# EAGLE design dIRKey (EAGLE 9.0.1)
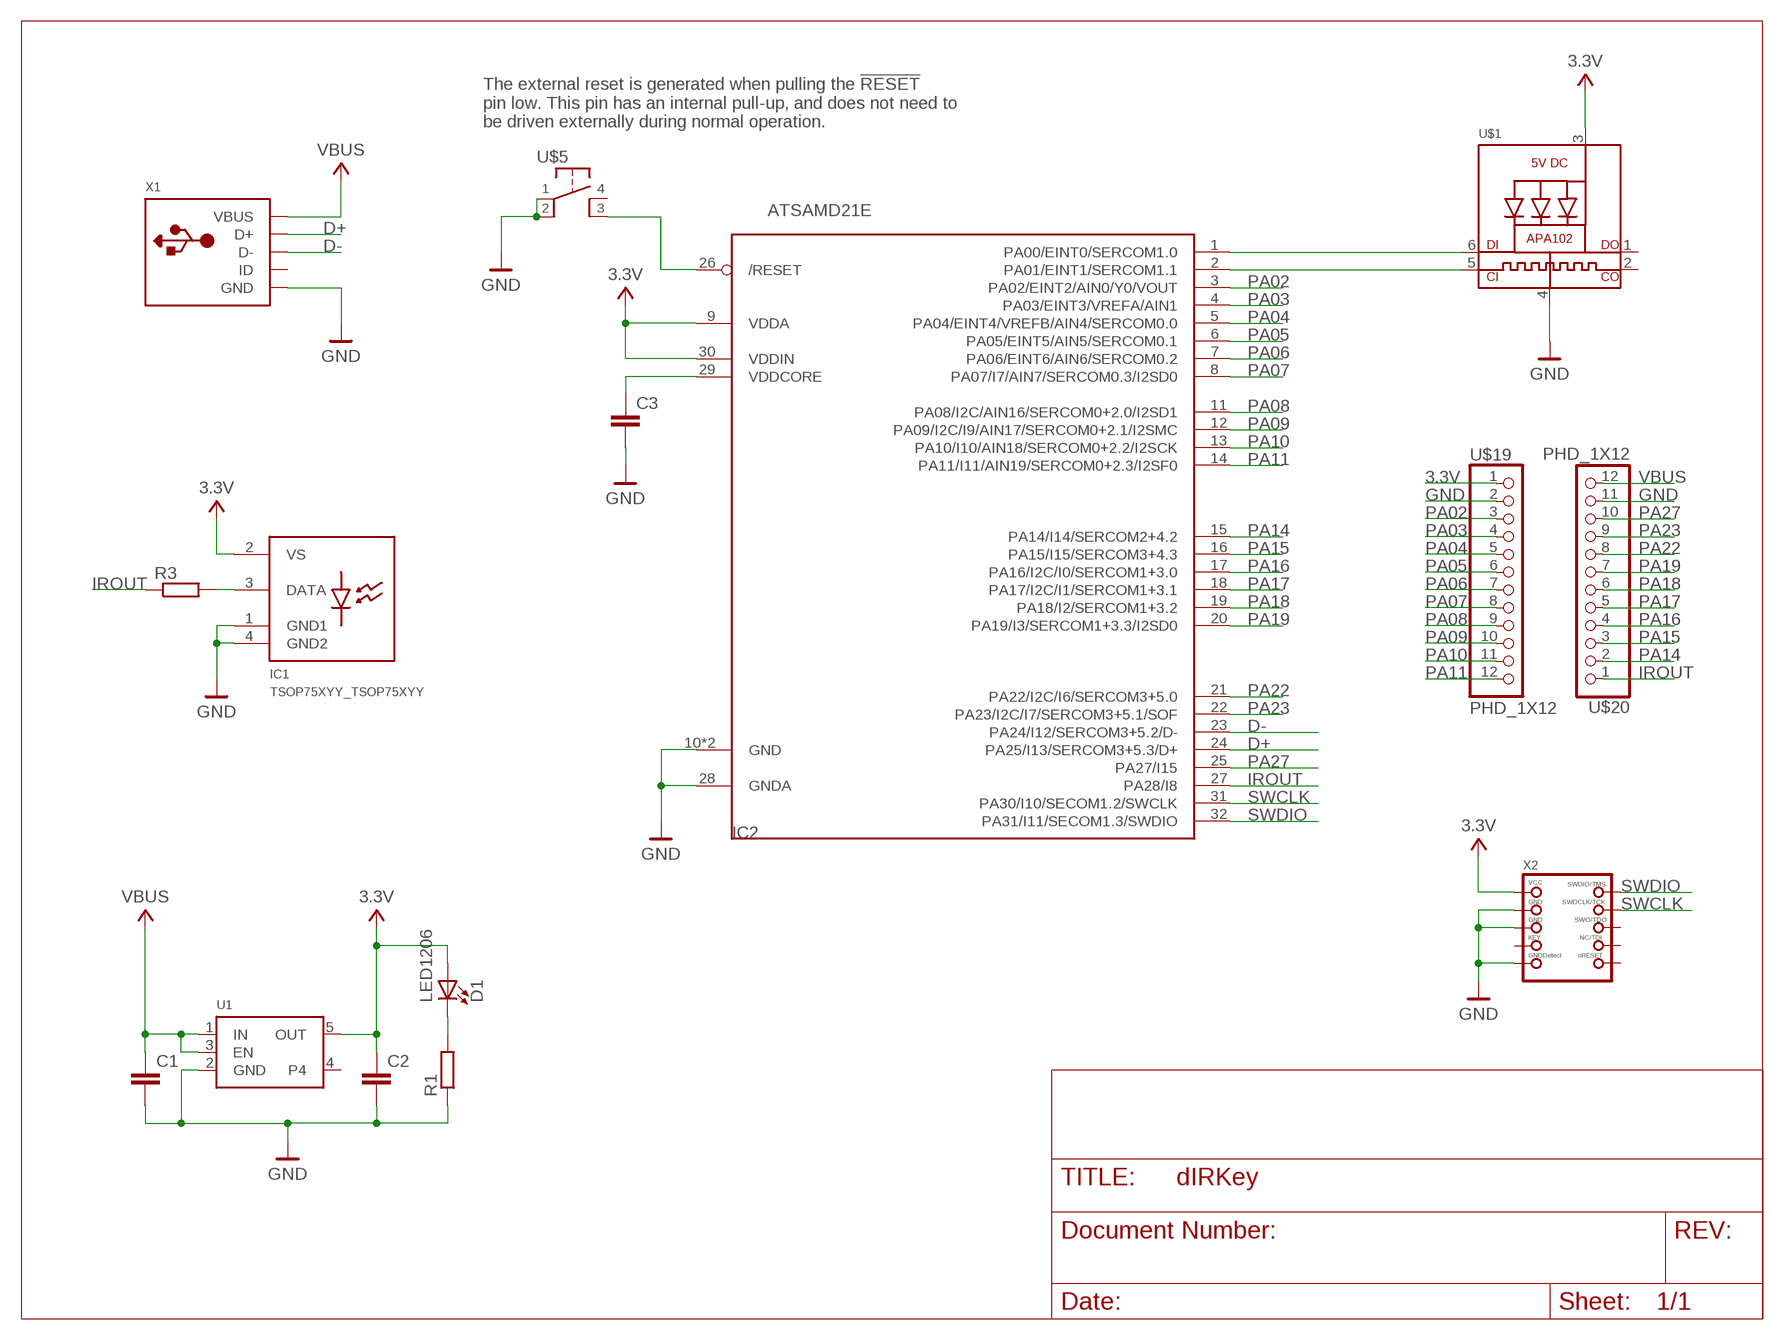
[diagram p0: schematic, sheet 1]

## Parts
C1  C-EUC1206  [C1206]
C2  C-EUC1206  [C1206]
C3  C-EUC1206  [C1206]
D1  LED1206  [LED1206]
IC1  TSOP75XYY_TSOP75XYY  [TSOP75XYY_TSOP75XYY]
IC2  ATSAMD21E  [QFN32_5MM]
R1  R-EU_R1206  [R1206]
R3  R-EU_R1206  [R1206]
U1  AP2112K  [SOT23-5]
U$1  DOTSTAR_APA1022020  [APA102_2020]
U$5  PTS647  [PTS647]
U$19  PHD_1X12  [PHD_1X12]
U$20  PHD_1X12  [PHD_1X12]
X1  USB_MICRO_BMICRO_20329  [USB_MICRO_B]
X2  SWD_2X5  [SWD_MINI]

## Nets
3.3V: C2.1 D1.2(A) IC1.2(VS) IC2.9(VDDA) IC2.30(VDDIN) U1.5(OUT) U$1.3(VDD) U$19.1 X2.1(VCC)
D+: IC2.24(PA25/I13/SERCOM3+5.3/D+) X1.D+
D-: IC2.23(PA24/I12/SERCOM3+5.2/D-) X1.D-
GND: C1.2 C2.2 C3.2 IC1.1(GND1) IC1.4(GND2) IC2.10(GND) IC2.28(GNDA) IC2.33(GND) R1.1 U1.2(GND) U$1.4(GND) U$5.1 U$5.2 U$19.2 U$20.11 X1.BASE@1(GND) X1.BASE@2(GND) X1.GND X1.SPRT@1(GND) X1.SPRT@2(GND) X1.SPRT@3(GND) X1.SPRT@4(GND) X2.3(GND) X2.5(GND) X2.9(GNDDETECT)
IROUT: IC2.27(PA28/I8) R3.1 U$20.1
N$1: IC2.1(PA00/EINT0/SERCOM1.0) U$1.6(DI)
N$2: IC2.2(PA01/EINT1/SERCOM1.1) U$1.5(CKI)
N$3: D1.1(C) R1.2
N$4: IC1.3(DATA) R3.2
N$7: C3.1 IC2.29(VDDCORE)
N$8: IC2.26(/RESET) U$5.3
PA02: IC2.3(PA02/EINT2/AIN0/Y0/VOUT) U$19.3
PA03: IC2.4(PA03/EINT3/VREFA/AIN1) U$19.4
PA04: IC2.5(PA04/EINT4/VREFB/AIN4/SERCOM0.0) U$19.5
PA05: IC2.6(PA05/EINT5/AIN5/SERCOM0.1) U$19.6
PA06: IC2.7(PA06/EINT6/AIN6/SERCOM0.2) U$19.7
PA07: IC2.8(PA07/I7/AIN7/SERCOM0.3/I2SD0) U$19.8
PA08: IC2.11(PA08/I2C/AIN16/SERCOM0+2.0/I2SD1) U$19.9
PA09: IC2.12(PA09/I2C/I9/AIN17/SERCOM0+2.1/I2SMC) U$19.10
PA10: IC2.13(PA10/I10/AIN18/SERCOM0+2.2/I2SCK) U$19.11
PA11: IC2.14(PA11/I11/AIN19/SERCOM0+2.3/I2SF0) U$19.12
PA14: IC2.15(PA14/I14/SERCOM2+4.2) U$20.2
PA15: IC2.16(PA15/I15/SERCOM3+4.3) U$20.3
PA16: IC2.17(PA16/I2C/I0/SERCOM1+3.0) U$20.4
PA17: IC2.18(PA17/I2C/I1/SERCOM1+3.1) U$20.5
PA18: IC2.19(PA18/I2/SERCOM1+3.2) U$20.6
PA19: IC2.20(PA19/I3/SERCOM1+3.3/I2SD0) U$20.7
PA22: IC2.21(PA22/I2C/I6/SERCOM3+5.0) U$20.8
PA23: IC2.22(PA23/I2C/I7/SERCOM3+5.1/SOF) U$20.9
PA27: IC2.25(PA27/I15) U$20.10
SWCLK: IC2.31(PA30/I10/SECOM1.2/SWCLK) X2.4(SWDCLK)
SWDIO: IC2.32(PA31/I11/SECOM1.3/SWDIO) X2.2(SWDIO)
VBUS: C1.1 U1.1(IN) U1.3(EN) U$20.12 X1.VBUS
Unconnected: U1.4 U$1.1(DO) U$1.2(CKO) U$5.4 X1.ID X2.6(SWO) X2.7(KEY) X2.8(TDI) X2.10(NRESET)

## Notes on the sheet
- The external reset is generated when pulling the !RESET
  pin low. This pin has an internal pull-up, and does not need to
  be driven externally during normal operation.

## Library data of the parts
C1-C3 = rcl:C-EU: CAPACITOR, European symbol; SPICEPREFIX: C
D1 = Ooo-LED:LED1206
IC1 = Ooo-Sensors-Optical:TSOP75XYY_TSOP75XYY: Vishay TSOP75XYY, where X is 2 (normal), or 4 (high noise environments, and YY is the demodulation frequency (36, 38, 40 KHz).
IC2 = Ooo-IC-Microcontroller:ATSAMD21E
R1 R3 = rcl:R-EU_: RESISTOR, European symbol; SPICEPREFIX: R
U1 = Ooo-IC-Power:AP2112K: SOT23-5 Fixed Voltage Regulators Part Current Out V Out V In V Dropout θJA (°C/W) TJ (°C) Digikey Part No. ADP121 150mA 3.3V 3.4-5.5V 0.09V @ 150mA -- -- ADP121-AUJZ33R7CT-ND ADP121 150mA 3.0V 3.1-5.5V 0.09V @ 150mA -- -- ADP121-AUJZ30R7CT-ND ADP122 300mA 3.3V 3.4-5.5V 0.085V @ 300mA -- -- ADP122AUJZ-3.3-R7CT-ND ADP1712 300mA 3.3V 3.5-5.5V 0.17V @ 300mA -- -- ADP1712AUJZ-3.3-R7TR-ND AP7311 (Low Cost) 150mA 3.3V 3.5-6V 0.15V @ 150mA -- -- AP7311-33WG-7DICT-ND LD39015M18R 150mA 1.8V 1.9V-5.5V 0.08V @ 100mA -- -- 497-6977-1-ND LP2985A-33DBVR 150mA 3.3V 3.3-16V 0.28V @ 150mA 206 150 296-18479-1-ND MCP1824T-3302E/OT 300mA 3.3V 3.5V-6V 0.2V @ 300mA -- -- MCP1824T-3302E/OTCT-ND MIC5205-2.5YM5 TR 150mA 2.5V 2.7-16V 0.165V @ 150mA -- -- 576-1257-2-ND MIC5205-3.0YM5 TR 150mA 3.0V 3.2V-16V 0.165V @ 150mA -- -- 576-1258-2-ND MIC5205-3.3YM5 TR 150mA 3.3V 3.5V-16V 0.165V @ 150mA -- -- 576-1259-2-ND TPS780330220 150mA 3.3V+2.2V 3.6-5.5V 250mV Max -- -- 296-23332-1-ND TDA3663/N1,135 100mA 3.3V 3.5-45V 0.18V @ 50mA -- -- 568-5343-1-ND Max operating temp can be calculated using θJA, TJ (max junction temperature), and power in watts. Set the "Maximum Ambient Temperature" until it reaches TJ ("Max Junction Temperature"), which is the absolute limit for safe use of the regulator: Heat Sink Temperature Calculator <http://www.daycounter.com/Calculators/Heat-Sink-Temperature-Calculator.phtml> For example, With 12V source into a 3.3V LP2985 and a 30mA load, we are dissipating (12V-3.3V) * 0.03A = 0.261W. With a θJA of 206 °C/W, a TJ of 150°C, and 261mW we can safely use the chip without a heat sink up to 75°C (=147.1°C Junction Temperature).
U$1 = Ooo-LED:DOTSTAR_APA102: APA102/DotStar Pixels VCC: 5V DC Refresh Rate: 400Hz
U$5 = Ooo-Switches:PTS647: C&K PTS647 Tact Switch
U$19 U$20 = Ooo-Connectors:PHD_1X12
X1 = Ooo-Connectors:USB_MICRO_B: USB Connectors USBMINIB - Surface Mount Female Mini-B USB Connector 4UConnector: 06564
X2 = Ooo-Connectors:SWD_2X5: SWD Connector Standard 0.05" 10-pin connector.

## Board
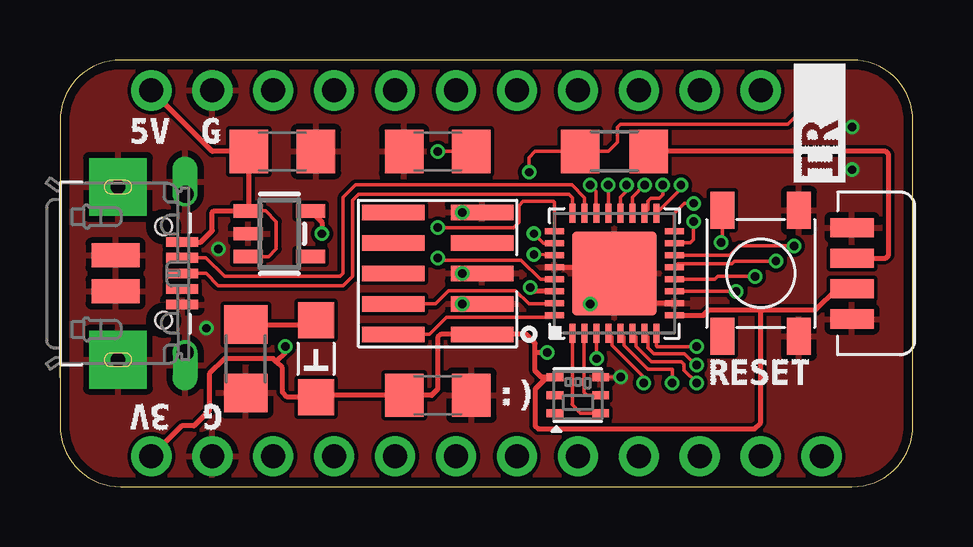
[diagram p1: board, top side]
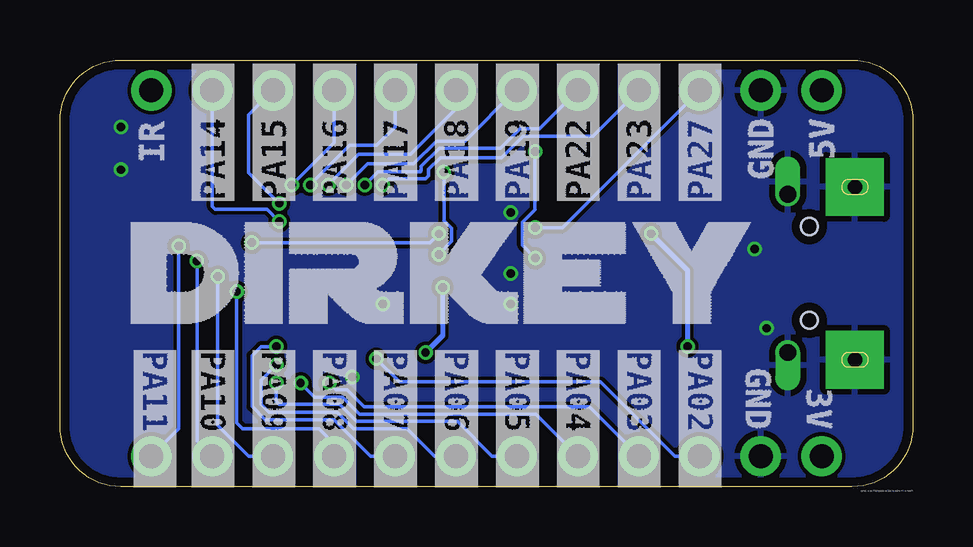
[diagram p2: board, bottom side, seen from below]

Size 35.56 x 17.78 mm. Coordinates in mm from the lower left corner, seen from the top.
Outline: 0,15.24 0,2.54 arc90 2.54,0 33.02,0 arc90 35.56,2.54 35.56,15.24 arc90 33.02,17.78 2.54,17.78 arc90 0,15.24
Copper layers (1*16): Top 0.035559375mm / dielectric 1.6mm / Bottom 0.035559375mm
Design rules "oshpark-2layer": minimum track width 6mil, minimum drill 10mil, track to track 6mil, track to pad 6mil, pad to pad 6mil, via to via 6mil, smd to smd 6mil, copper to edge 15mil, drill to drill 6mil, minimum pad ring 5mil, minimum via ring 5mil, stop-mask expansion 2.5mil, vias tented up to drill 0mil, thermal gap 10mil

### Footprints (pad centres in the part's own frame; a part is rotated, then mirrored left to right if it is on the bottom)
C1206 = smd 1.6 x 1.8: 1 -1.4,0; 2 1.4,0
LED1206 = smd 1.5 x 1.5: 1 -1.6,0; 2 1.6,0
TSOP75XYY_TSOP75XYY = smd 0.8 x 1.8: 1 -1.905,0; 2 -0.635,0; 3 0.635,0; 4 1.905,0
QFN32_5MM = smd 0.8 x 0.25: 1 -2.5,1.75; 2 -2.5,1.25; 3 -2.5,0.75; 4 -2.5,0.25; 5 -2.5,-0.25; 6 -2.5,-0.75; 7 -2.5,-1.25; 8 -2.5,-1.75; 17 2.5,-1.75; 18 2.5,-1.25; 19 2.5,-0.75; 20 2.5,-0.25; 21 2.5,0.25; 22 2.5,0.75; 23 2.5,1.25; 24 2.5,1.75 | smd 0.25 x 0.8: 9 -1.75,-2.5; 10 -1.25,-2.5; 11 -0.75,-2.5; 12 -0.25,-2.5; 13 0.25,-2.5; 14 0.75,-2.5; 15 1.25,-2.5; 16 1.75,-2.5; 25 1.75,2.5; 26 1.25,2.5; 27 0.75,2.5; 28 0.25,2.5; 29 -0.25,2.5; 30 -0.75,2.5; 31 -1.25,2.5; 32 -1.75,2.5 | smd 3.5 x 3.5: 33 0,0
R1206 = smd 1.6 x 1.803: 1 -1.422,0; 2 1.422,0
SOT23-5 = smd 0.55 x 1.2: 1 -0.95,-1.3; 2 0,-1.3; 3 0.95,-1.3; 4 0.95,1.3; 5 -0.95,1.3
APA102_2020 = smd 0.7 x 0.35: 1 -0.95,-0.75; 2 -0.95,0; 3 -0.95,0.75; 4 0.95,0.75; 5 0.95,0; 6 0.95,-0.75
PTS647 = smd 1.55 x 1: 1 -2.625,1.6; 2 2.625,1.6; 3 -2.625,-1.6; 4 2.625,-1.6
PHD_1X12 = drill 1 pad 1.676: 1 0,0; 2 2.54,0; 3 5.08,0; 4 7.62,0; 5 10.16,0; 6 12.7,0; 7 15.24,0; 8 17.78,0; 9 20.32,0; 10 22.86,0; 11 25.4,0; 12 27.94,0
USB_MICRO_B = smd 1 x 2: BASE@1 -0.75,-2; BASE@2 0.75,-2 | smd 0.4 x 1.35: D+ 0,0.775; D- -0.65,0.775; GND 1.3,0.775; ID 0.65,0.775; VBUS -1.3,0.775 | drill 0.7 offset: SPRT@1 -3.3,0.9; SPRT@2 3.3,0.9 | drill 0.6 pad 2.413 square: SPRT@3 -3.6,-1.9; SPRT@4 3.6,-1.9 | hole 0.7: -1.95,0; 1.95,0
SWD_MINI = smd 0.65 x 2.6: 1 -2.54,-1.85; 2 -2.54,1.85; 3 -1.27,-1.85; 4 -1.27,1.85; 5 0,-1.85; 6 0,1.85; 7 1.27,-1.85; 8 1.27,1.85; 9 2.54,-1.85; 10 2.54,1.85

### Placement (x,y rotation side)
C1  9.27,13.97 0 top
C2  15.75,3.81 0 top
C3  15.75,13.97 180 top
D1  10.67,5.33 270 top
IC1  33.02,8.89 90 top
IC2  23.11,8.89 90 top
R1  7.75,5.33 90 top
R3  23.11,13.97 0 top
U1  9.14,10.54 270 top
U$1  21.59,3.81 0 top
U$5  29.21,8.89 270 top
U$19  3.81,1.27 0 top
U$20  31.75,16.51 180 top
X1  4.32,8.89 270 top
X2  15.75,8.89 90 top

### Tracks (layer width: path | path; a pad name or v marks a point on that pad's centre or on a via)
3.3V  (via drill 0.35)
  Top 0.203: 9.02,5.21 9.27,4.95 9.27,3.94 9.47,3.73 D1.2 10.74,3.81 C2.1 15.49,3.81 15.75,4.06 15.75,6.22 15.88,6.35 X2.1 19.43,6.35 19.81,5.97 19.81,5.59 | 9.02,5.21 8.89,5.33 6.86,5.33 6.22,4.7 6.22,3.17 5.59,2.54 5.08,2.54 U$19.1 | 25.64,7.11 IC2.9 26.82,7.14 27.05,7.37 29.21,7.37 | 19.81,5.59 19.81,4.83 20.08,4.56 U$1.3 20.31,4.56 19.81,4.06 19.81,2.54 19.94,2.41 28.96,2.41 29.21,2.67 29.21,7.37 | 29.21,7.37 31.5,7.37 32.38,8.26 IC1.2 | IC2.30 19.78,8.14 v19.61,8.31 | v20.32,5.59 19.81,5.59 | U1.5 10.92,11.01 v10.92,10.54 | v9.4,5.84 9.4,5.59 9.02,5.21
  Bottom 0.203: v19.61,8.31 19.61,6.3 v20.32,5.59 | v10.92,10.54 9.4,9.02 v9.4,5.84
D+
  Top 0.152: IC2.24 21.36,12.04 21.21,12.19 12.45,12.19 12.19,11.94 12.19,8.76 11.81,8.38 6.6,8.38 6.1,8.89 X1.D+
D-
  Top 0.152: X1.D- 6.08,9.54 6.86,8.76 11.68,8.76 11.81,8.89 11.81,12.06 12.32,12.57 21.34,12.57 21.86,12.04 IC2.23
GND  (via drill 0.35)
  Top 0.152: U$1.4 22.85,4.56 v23.37,4.57
  Top 0.203: IC2.28 22.86,9.14 IC2.33 | IC2.10 24.36,7.64 IC2.33 | IC2.33 22.1,7.87 v22.1,7.62
  other vias: 6.1,6.6 33.02,14.99 33.02,13.21 16.76,7.62 16.76,8.89 16.76,11.43 6.6,9.91
  pour Top: 0,0 0,17.78 35.56,17.78 35.56,0
  pour Bottom: 0,0 0,17.78 35.56,17.78 35.56,0
IROUT  (via drill 0.35)
  Top 0.152: U$20.1 30.35,15.11 23.37,15.11 23.24,14.99 23.24,14.35 22.86,13.97 R3.1 19.81,13.97 19.56,13.72 v19.56,13.1 | IC2.27 20.6,9.65 v19.76,9.68
  Bottom 0.152: v19.56,13.1 19.56,11.09 19.23,10.76 19.23,10.23 v19.76,9.68
N$1
  Top 0.152: U$1.6 21.7,3.06 21.34,3.43 21.36,3.46 IC2.1
N$2
  Top 0.152: U$1.5 21.97,3.81 21.84,3.94 21.84,6.37 IC2.2
N$3
  Top 0.152: 10.63,6.9 D1.1
  Top 0.203: R1.2 10.49,6.76 10.63,6.9
N$4
  Top 0.203: IC1.3 34.42,9.53 34.54,9.65 34.54,13.84 34.42,13.97 R3.2
N$7  (via drill 0.35)
  Top 0.152: C3.1 v15.75,13.97 | IC2.29 20.03,8.64 19.22,9.44 15.83,9.44 v15.75,9.53
  Bottom 0.152: v15.75,13.97 15.75,11.54 16.28,11.02 16.28,10.06 v15.75,9.53
N$8  (via drill 0.35)
  Top 0.152: U$5.3 27.61,10.22 v27.56,10.17 | v19.76,10.54 20.16,10.14 IC2.26
  Bottom 0.152: v27.56,10.17 20.13,10.17 v19.76,10.54
PA02  (via drill 0.35)
  Top 0.152: IC2.3 22.36,5.83 22.38,5.82 v22.38,5.33
  Bottom 0.152: v22.38,5.33 21.41,4.37 13.02,4.37 9.92,1.27 U$19.3
PA03  (via drill 0.35)
  Top 0.152: IC2.4 23.01,6.24 23.01,5.89 24.33,4.57 v24.33,4.32
  Bottom 0.152: U$19.4 13.49,3.33 22.89,3.33 23.6,4.04 24.05,4.04 v24.33,4.32
PA04  (via drill 0.35)
  Top 0.152: IC2.5 23.51,6.24 23.51,5.89 24.5,4.9 25.53,4.9 v25.53,4.32
  Bottom 0.152: U$19.5 15.72,3.02 23.07,3.02 23.78,3.73 24.94,3.73 v25.53,4.32
PA05  (via drill 0.35)
  Top 0.152: IC2.6 24.01,6.24 24.01,5.86 24.66,5.21 25.91,5.21 26.01,5.1 26.01,4.86 v26.54,4.33 v26.54,4.32
  Bottom 0.152: U$19.6 17.54,1.27 18.99,2.72 23.19,2.72 23.9,3.43 26.42,3.43 26.54,3.56 v26.54,4.32
PA06  (via drill 0.35)
  Top 0.152: IC2.7 24.51,6.24 24.51,5.79 24.77,5.54 26.04,5.54 26.49,5.08 v26.54,5.08
  Bottom 0.152: U$19.7 19.94,1.27 21.08,2.41 23.32,2.41 24,3.1 26.85,3.1 27.18,3.43 27.18,4.45 v26.54,5.08
PA07  (via drill 0.35)
  Top 0.152: IC2.8 24.86,5.87 24.89,5.84 v26.54,5.84
  Bottom 0.152: U$19.8 22.61,1.27 24.13,2.79 27,2.79 27.56,3.35 27.56,5.46 27.18,5.84 v26.54,5.84
PA08  (via drill 0.35)
  Top 0.152: IC2.11 28.05,8.14 v28.19,8.13
  Bottom 0.152: U$19.9 24.13,1.78 24.77,2.41 27.94,2.41 28.19,2.67 v28.19,8.13
PA09  (via drill 0.35)
  Top 0.152: IC2.12 27.3,8.64 27.43,8.76 v28.98,8.76
  Bottom 0.152: v28.98,8.76 28.98,2.56 27.69,1.27 U$19.10
PA10  (via drill 0.35)
  Top 0.152: IC2.13 25.76,9.29 28,9.29 28.12,9.4 v29.84,9.4
  Bottom 0.152: v29.84,9.4 29.84,1.91 U$19.11
PA11  (via drill 0.35)
  Top 0.152: IC2.14 27.93,9.64 28.32,10.03 v30.61,10.03
  Bottom 0.152: v30.61,10.03 30.61,2.41 U$19.12
PA14  (via drill 0.35)
  Top 0.152: IC2.15 25.63,10.16 26.29,10.16 26.42,10.29 v26.42,11.05
  Bottom 0.152: v26.42,11.05 26.92,11.56 29.08,11.56 29.21,11.68 U$20.2
PA15  (via drill 0.35)
  Top 0.152: IC2.16 25.61,11.39 26.04,11.81 v26.42,11.81
  Bottom 0.152: v26.42,11.81 27.69,13.08 27.69,15.49 U$20.3
PA16  (via drill 0.35)
  Top 0.152: IC2.17 25.89,12.41 v25.89,12.57
  Bottom 0.152: v25.89,12.57 24.13,14.33 U$20.4
PA17  (via drill 0.35)
  Top 0.152: v25.13,12.57 25.13,12.15 24.99,12.02 24.64,12.02 24.51,11.88 24.51,11.54 IC2.18
  Bottom 0.152: v25.13,12.57 23.48,14.22 22.35,14.22 21.59,14.99 U$20.5
PA18  (via drill 0.35)
  Top 0.152: IC2.19 23.86,12.06 v24.37,12.57
  Bottom 0.152: v24.37,12.57 23.1,13.84 20.95,13.84 19.05,15.75 U$20.6
PA19  (via drill 0.35)
  Top 0.152: IC2.20 23.36,12.06 23.62,12.31 v23.62,12.57
  Bottom 0.152: v23.62,12.57 22.73,13.46 20.81,13.46 19.87,14.4 18.67,14.4 16.56,16.51 U$20.7
PA22  (via drill 0.35)
  Top 0.152: IC2.21 v22.86,12.57
  Bottom 0.152: v22.86,12.57 22.85,12.57 22.29,13.13 20.52,13.13 20.5,13.16 20.5,13.35 19.75,14.1 17.2,14.1 16.38,14.91 15.57,14.91 U$20.8
PA23  (via drill 0.35)
  Top 0.152: IC2.22 22.35,11.4 22.35,12.32 v22.1,12.57
  Bottom 0.152: v22.1,12.57 21.84,12.83 20.32,12.83 20.19,12.95 20.19,13.22 19.7,13.72 17.14,13.72 16.26,14.61 13.34,14.61 U$20.9
PA27  (via drill 0.35)
  Top 0.152: IC2.25 20.61,11.85 20.57,11.89 19.3,11.89 19.13,11.71 19.13,11.01 18.91,10.79 v15.75,10.79
  Bottom 0.152: v15.75,10.79 14.61,10.79 U$20.10
SWCLK
  Top 0.152: IC2.31 20.55,7.58 20.5,7.62 19.55,7.62 18.99,8.17 16.2,8.17 15.65,7.62 X2.4
SWDIO
  Top 0.152: X2.2 15.41,6.35 16.12,7.07 20.54,7.07 IC2.32
VBUS
  Top 0.152: U1.3 8.7,9.59 9.02,9.91 9.02,11.05 8.57,11.49 U1.1
  Top 0.203: X1.VBUS 5.87,10.19 6.35,10.67 6.35,11.43 6.41,11.49 U1.1 7.87,11.52 C1.1 6.35,13.97 U$20.12

### Text on the board
bPlace: /home/methuzla/Desktop/bPlace.bmp